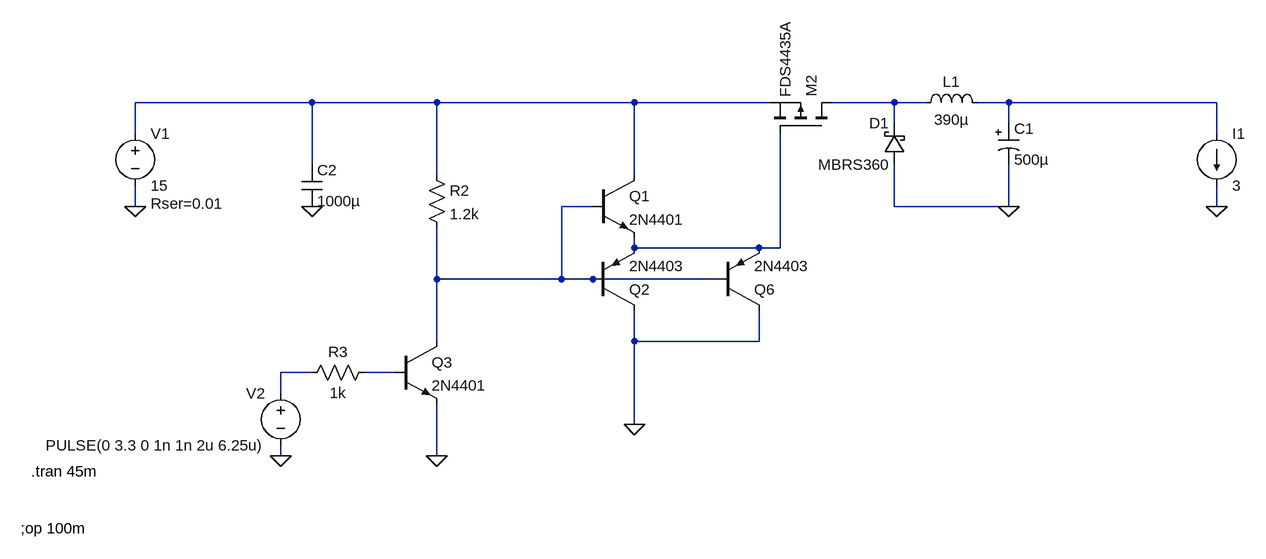
[diagram p0: schematic Buck Sim.asc]
Buck Sim.asc, the LTspice schematic file:
Version 4
SHEET 1 1988 2104
WIRE -480 64 -752 64
WIRE -288 64 -480 64
WIRE 16 64 -288 64
WIRE 224 64 16 64
WIRE 416 64 320 64
WIRE 464 64 416 64
WIRE 592 64 544 64
WIRE 912 64 592 64
WIRE 416 96 416 64
WIRE 592 96 592 64
WIRE -752 112 -752 64
WIRE 912 112 912 64
WIRE -480 160 -480 64
WIRE -288 176 -288 64
WIRE 16 176 16 64
WIRE -752 224 -752 192
WIRE -48 224 -96 224
WIRE 416 224 416 160
WIRE 592 224 592 160
WIRE 592 224 416 224
WIRE 912 224 912 192
WIRE 16 288 16 272
WIRE 208 288 16 288
WIRE 240 288 240 112
WIRE 240 288 208 288
WIRE -288 336 -288 256
WIRE -96 336 -96 224
WIRE -96 336 -288 336
WIRE -48 336 -96 336
WIRE 144 336 -48 336
WIRE -288 432 -288 336
WIRE 16 432 16 384
WIRE 208 432 208 384
WIRE 208 432 16 432
WIRE -480 480 -528 480
WIRE -352 480 -400 480
WIRE -528 512 -528 480
WIRE 16 560 16 432
WIRE -528 608 -528 592
WIRE -288 608 -288 528
FLAG -528 608 0
FLAG -752 224 0
FLAG -288 608 0
FLAG 16 560 0
FLAG 592 224 0
FLAG -480 224 0
FLAG 912 224 0
SYMBOL schottky 432 160 R180
WINDOW 0 24 64 Left 2
WINDOW 3 24 0 Left 2
SYMATTR InstName D1
SYMATTR Value MBRS360
SYMATTR Description Diode
SYMATTR Type diode
SYMBOL ind 448 80 R270
WINDOW 0 32 56 VTop 2
WINDOW 3 5 56 VBottom 2
SYMATTR InstName L1
SYMATTR Value 390µ
SYMATTR SpiceLine Rser=72m
SYMBOL voltage -752 96 R0
WINDOW 123 0 0 Left 0
WINDOW 39 24 124 Left 2
SYMATTR SpiceLine Rser=0.01
SYMATTR InstName V1
SYMATTR Value 15
SYMBOL voltage -528 496 M0
WINDOW 123 0 0 Left 0
WINDOW 39 0 0 Left 0
SYMATTR InstName V2
SYMATTR Value PULSE(0 3.3 0 1n 1n 2u 6.25u)
SYMBOL res -304 160 R0
SYMATTR InstName R2
SYMATTR Value 1.2k
SYMBOL res -384 464 R90
WINDOW 0 0 56 VBottom 2
WINDOW 3 32 56 VTop 2
SYMATTR InstName R3
SYMATTR Value 1k
SYMBOL npn -352 432 R0
SYMATTR InstName Q3
SYMATTR Value 2N4401
SYMBOL npn -48 176 R0
SYMATTR InstName Q1
SYMATTR Value 2N4401
SYMBOL pnp -48 384 M180
SYMATTR InstName Q2
SYMATTR Value 2N4403
SYMBOL pmos 320 112 M270
SYMATTR InstName M2
SYMATTR Value FDS4435A
SYMBOL polcap 576 96 R0
SYMATTR InstName C1
SYMATTR Value 500µ
SYMATTR SpiceLine Rser=74m
SYMBOL pnp 144 384 M180
SYMATTR InstName Q6
SYMATTR Value 2N4403
SYMBOL cap -496 160 R0
SYMATTR InstName C2
SYMATTR Value 1000µ
SYMBOL current 912 112 R0
WINDOW 123 0 0 Left 0
WINDOW 39 0 0 Left 0
SYMATTR InstName I1
SYMATTR Value 3
TEXT -912 632 Left 2 !.tran 45m
TEXT -928 720 Left 2 !;op 100m

The netlist it stands for:
* Buck Sim.asc
D1 0 N002 MBRS360
L1 N002 N003 390µ Rser=72m
V1 N001 0 15 Rser=0.01
V2 N006 0 PULSE(0 3.3 0 1n 1n 2u 6.25u)
R2 N001 N004 1.2k
R3 N007 N006 1k
Q3 N004 N007 0 0 2N4401
Q1 N001 N004 N005 0 2N4401
Q2 0 N004 N005 0 2N4403
M2 N002 N005 N001 N001 FDS4435A
C1 N003 0 500µ Rser=74m
Q6 0 N004 N005 0 2N4403
C2 N001 0 1000µ
I1 N003 0 3
.model D D
.lib standard.dio
.model NPN NPN
.model PNP PNP
.lib standard.bjt
.model NMOS NMOS
.model PMOS PMOS
.lib standard.mos
.tran 45m
;op 100m
.backanno
.end